# EAGLE design rtk1010_test (EAGLE 9.6.2)
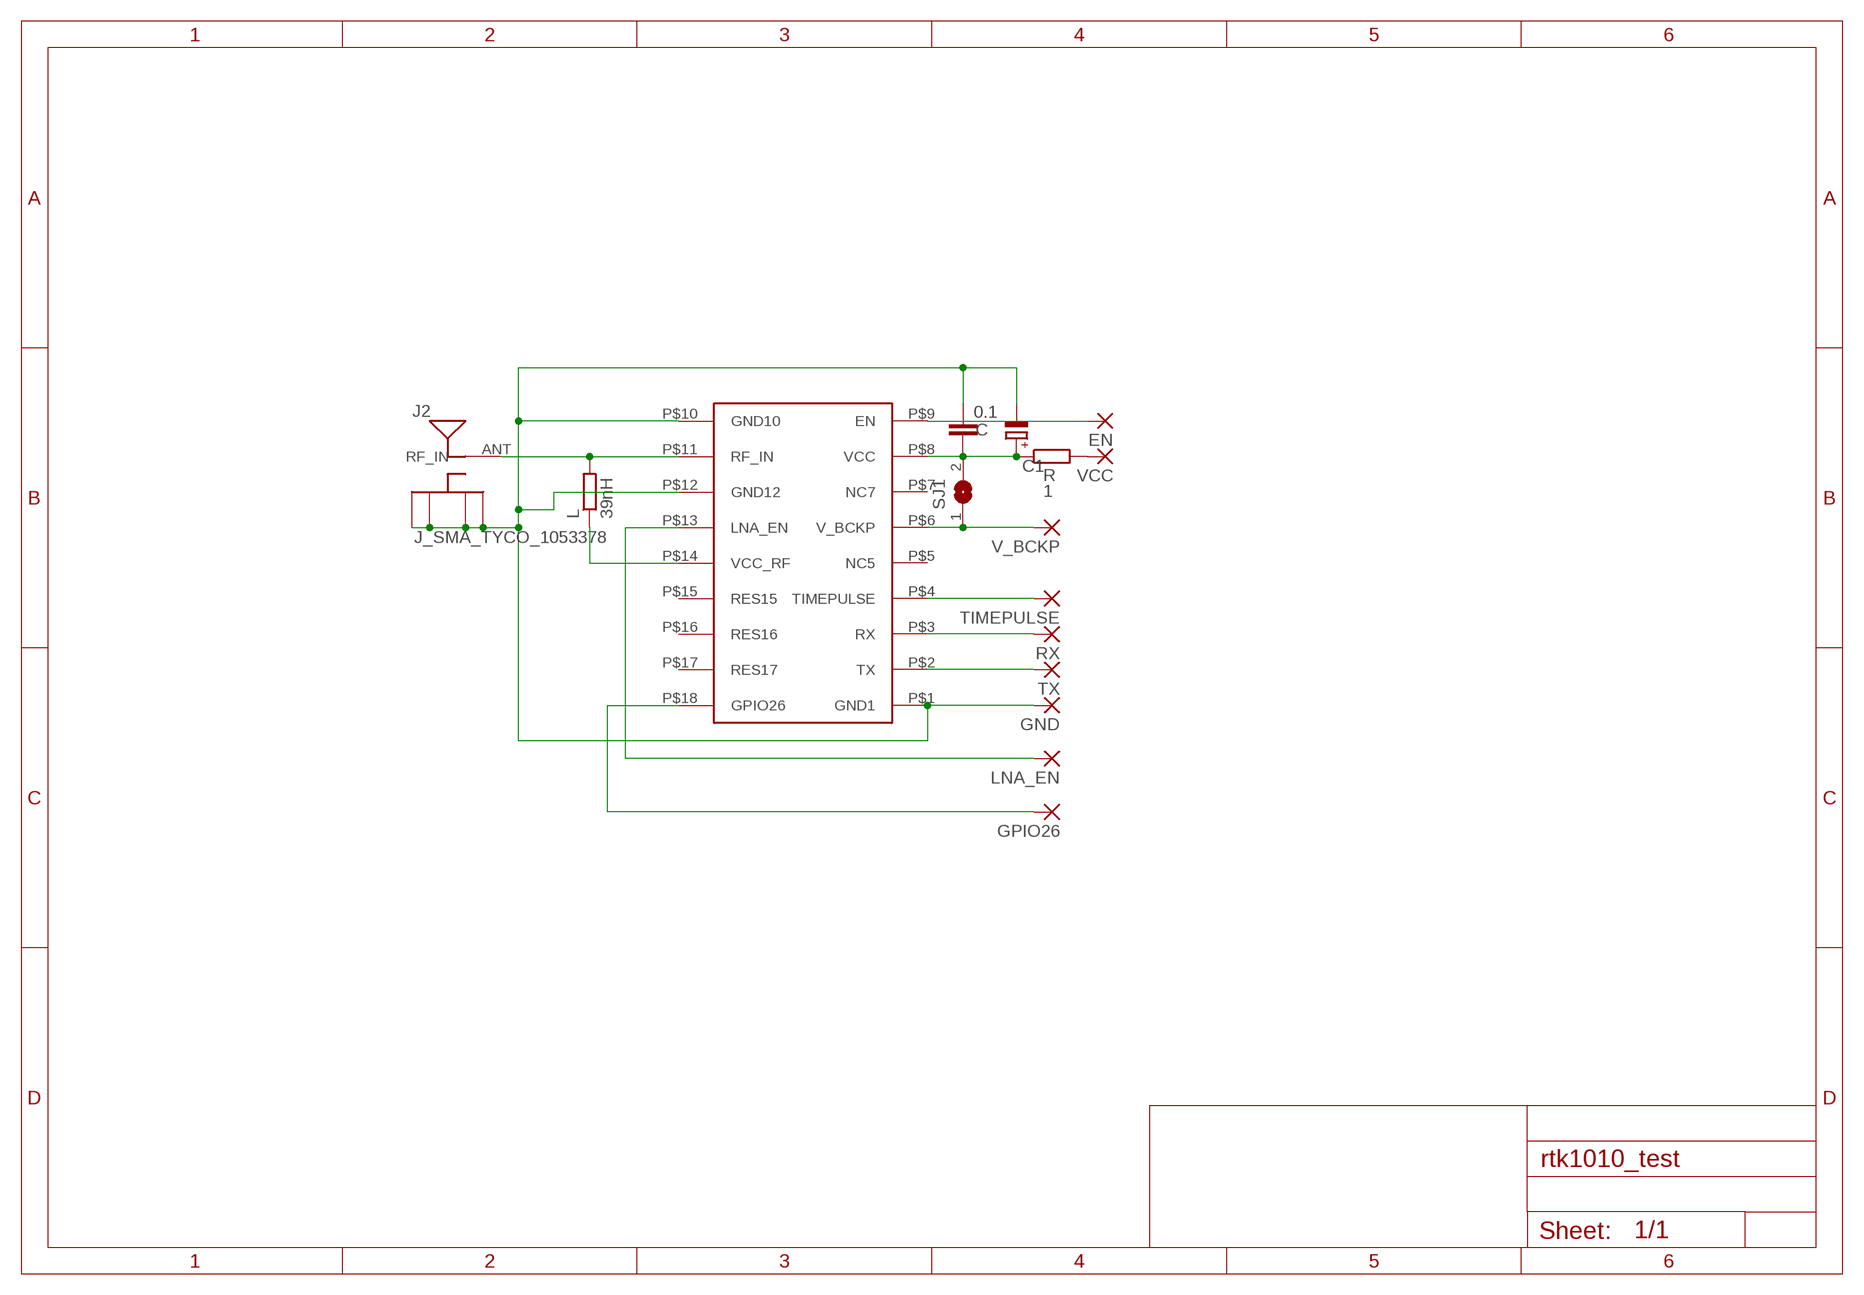
[diagram p0: schematic, sheet 1]

## Parts
C  0.1  C-EUC0805  [C0805]
C1  CPOL-EUSMCB  [SMC_B]
EN  2,15/1,0  [2,15/1,0]
GND  2,15/1,0  [2,15/1,0]
GPIO26  2,15/1,0  [2,15/1,0]
J2  J_SMA_TYCO_1053378  [1053378-1]
L  39nH  R-EU_R0805  [R0805]
LNA_EN  2,15/1,0  [2,15/1,0]
R  1  R-EU_R0805  [R0805]
RX  2,15/1,0  [2,15/1,0]
SJ1  SJW  [SJW]
TIMEPULSE  2,15/1,0  [2,15/1,0]
TX  2,15/1,0  [2,15/1,0]
U$1  RTK-1010  [RTK-1010]
V_BCKP  2,15/1,0  [2,15/1,0]
VCC  2,15/1,0  [2,15/1,0]

## Nets
EN: EN.1(P) U$1.P$9(EN)
GND: C1.- C.2 GND.1(P) J2.GND_1(RFGND_1) J2.GND_2(RFGND_2) J2.GND_3(RFGND_3) J2.GND_4(RFGND_4) U$1.P$1(GND1) U$1.P$10(GND10) U$1.P$12(GND12)
GPIO26: GPIO26.1(P) U$1.P$18(GPIO26)
LNA_EN: LNA_EN.1(P) U$1.P$13(LNA_EN)
N$8: L.1 U$1.P$14(VCC_RF)
N$11: R.2 VCC.1(P)
RF_IN: J2.ANT(RF_IN) L.2 U$1.P$11(RF_IN)
RX: RX.1(P) U$1.P$3(RX)
TIMEPULSE: TIMEPULSE.1(P) U$1.P$4(TIMEPULSE)
TX: TX.1(P) U$1.P$2(TX)
V_BKUP: SJ1.1 U$1.P$6(V_BCKP) V_BCKP.1(P)
VCC: C1.+ C.1 R.1 SJ1.2 U$1.P$8(VCC)
Unconnected: U$1.P$5(NC5) U$1.P$7(NC7) U$1.P$15(RES15) U$1.P$16(RES16) U$1.P$17(RES17)

## Library data of the parts
C = rcl:C-EU: CAPACITOR, European symbol; SPICEPREFIX: C
C1 = rcl:CPOL-EU: POLARIZED CAPACITOR, European symbol; SPICEPREFIX: C
EN GND GPIO26 LNA_EN RX TIMEPULSE TX V_BCKP VCC = wirepad:2,15/1,0: THROUGH-HOLE PAD
J2 = j_sma_tyco_1053378-1:J_SMA_TYCO_1053378: Tyco SMA Antenna
L R = rcl:R-EU_: RESISTOR, European symbol; SPICEPREFIX: R
SJ1 = jumper:SJ: SMD solder JUMPER
U$1 = rtk1010:RTK-1010

## Board
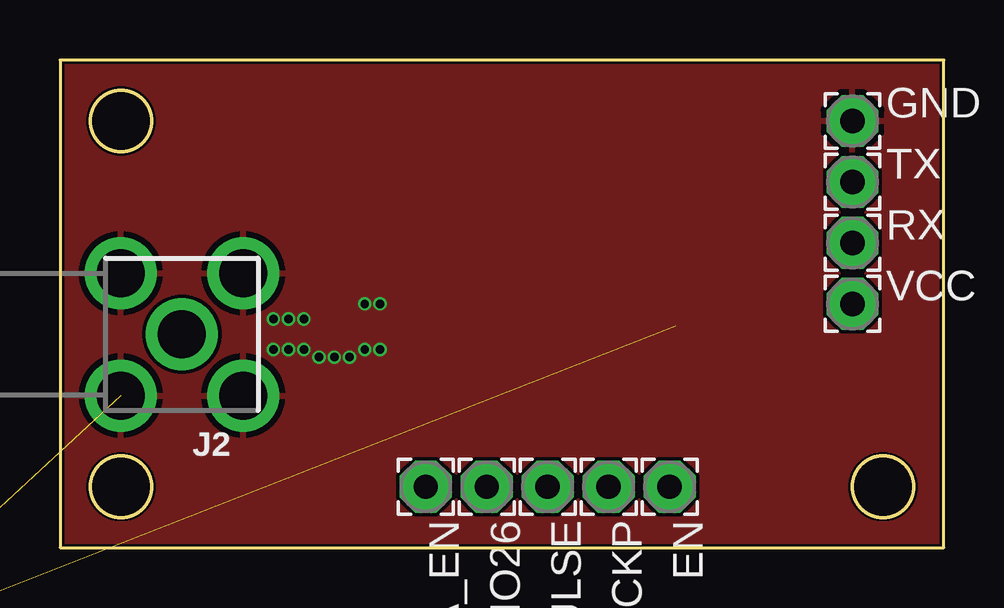
[diagram p1: board, top side]
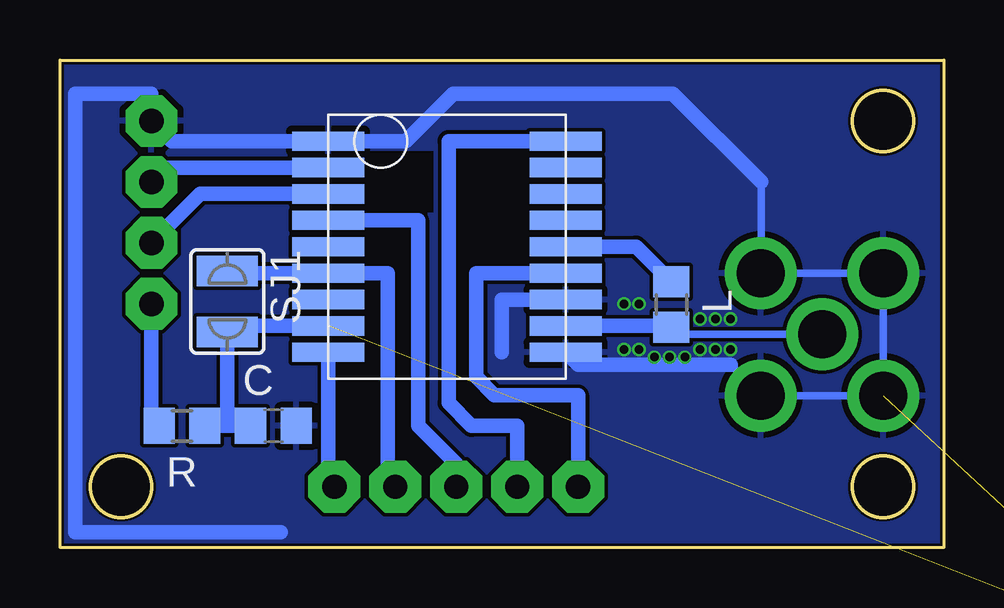
[diagram p2: board, bottom side, seen from below]

Size 36.83 x 20.32 mm. Coordinates in mm from the lower left corner, seen from the top.
Outline: 0,0 36.83,0 36.83,20.32 0,20.32 0,0
Outline: circle at 2.54,2.54 radius 1.27
Outline: circle at 2.54,17.78 radius 1.27
Outline: circle at 34.29,2.54 radius 1.27
Copper layers (1*16): Top 0.035mm / dielectric 0.2mm / Bottom 0.035mm
Design rules "jlcpcb-2-layer *": minimum track width 3.5mil, minimum drill 0.2mm, track to track 6mil, track to pad 6mil, pad to pad 6mil, via to via 6mil, smd to smd 0mil, copper to edge 0.1mm, drill to drill 5mil, minimum pad ring 4mil, minimum via ring 4mil, stop-mask expansion 3mil, vias tented up to drill 100mil, thermal gap 10mil
bRestrict: area 21.3,14 to 24.1,16.5

### Footprints (pad centres in the part's own frame; a part is rotated, then mirrored left to right if it is on the bottom)
C0805 = smd 1.3 x 1.5: 1 -0.95,0; 2 0.95,0
SMC_B = smd 1.6 x 2.4: + -1.5,0; - 1.5,0
2,15/1,0 = drill 1.016 pad 2.159 octagon: 1 0,0
1053378-1 = drill 2 pad 3: ANT 0,0; GND_1 2.55,2.55; GND_2 2.55,-2.55; GND_3 -2.55,2.55; GND_4 -2.55,-2.55
R0805 = smd 1.3 x 1.5: 1 -0.95,0; 2 0.95,0
SJW = smd 1.27 x 2.54: 1 -1.27,0; 2 1.27,0
RTK-1010 = smd 3 x 0.8: P$1 9.9,0; P$2 9.9,1.1; P$3 9.9,2.2; P$4 9.9,3.3; P$5 9.9,4.4; P$6 9.9,5.5; P$7 9.9,6.6; P$8 9.9,7.7; P$9 9.9,8.8; P$10 0,8.8; P$11 0,7.7; P$12 0,6.6; P$13 0,5.5; P$14 0,4.4; P$15 0,3.3; P$16 0,2.2; P$17 0,1.1; P$18 0,0

### Placement (x,y rotation side)
C  27.94,5.08 0 bottom
C1  -12.7,-6.35 0 top  (outside the outline)
EN  25.4,2.54 270 top
GND  33.02,17.78 270 top
GPIO26  17.78,2.54 270 top
J2  5.08,8.89 180 top
L  11.36,10.13 270 bottom
LNA_EN  15.24,2.54 270 top
R  31.75,5.08 180 bottom
RX  33.02,12.7 270 top
SJ1  29.86,10.26 270 bottom
TIMEPULSE  20.32,2.54 270 top
TX  33.02,15.24 270 top
U$1  15.76,16.94 180 bottom
V_BCKP  22.86,2.54 270 top
VCC  33.02,10.16 0 top

### Tracks (layer width: path | path; a pad name or v marks a point on that pad's centre or on a via)
EN
  Bottom 0.61: U$1.P$9 25.66,2.8 EN.1
GND  (via drill 0.35)  (1 unrouted)
  Bottom 0.305: 7.62,15.24 J2.GND_4 J2.GND_2 J2.GND_1 J2.GND_3 7.63,6.36 8.89,7.62
  Bottom 0.61: U$1.P$12 18.41,10.34 18.41,8.14 | 27.62,0.64 36.2,0.64 36.2,18.92 33.02,18.92 GND.1 32.18,16.94 U$1.P$1 22.43,16.94 20.45,18.92 11.3,18.92 7.62,15.24 | U$1.P$10 15.24,7.62 8.89,7.62
  other vias: 8.89,8.26 9.53,8.26 10.16,8.26 8.89,9.53 9.53,9.53 10.16,9.53 12.7,10.16 13.34,10.16 13.34,8.26 12.7,8.26 10.79,7.94 11.43,7.94 12.06,7.94
  pour Bottom: 0,0 36.83,0 36.83,20.32 0,20.32
  pour Top: 0,0 36.83,0 36.83,20.32 0,20.32
GPIO26
  Bottom 0.61: U$1.P$18 20.64,16.94 20.64,6.03 19.68,5.08 17.78,5.08 GPIO26.1
LNA_EN
  Bottom 0.61: LNA_EN.1 15.24,6.35 18.73,6.35 19.49,7.11 19.49,11.44 U$1.P$13
N$8
  Bottom 0.61: U$1.P$14 12.82,12.54 L.1
N$11
  Bottom 0.61: VCC.1 33.02,5.4 R.2
RF_IN
  Bottom 0.305: J2.ANT 11.36,8.89
  Bottom 0.61: 11.36,8.89 L.2 11.42,9.24 U$1.P$11
RX
  Bottom 0.61: U$1.P$3 30.98,14.74 RX.1
TIMEPULSE
  Bottom 0.61: U$1.P$4 21.91,13.64 21.91,5.08 20.32,3.49 TIMEPULSE.1
TX
  Bottom 0.61: U$1.P$2 32.42,15.84 TX.1
V_BKUP
  Bottom 0.61: SJ1.1 29.77,11.44 U$1.P$6 23.18,11.43 23.18,2.86 V_BCKP.1
VCC  (1 unrouted)
  Bottom 0.152: 30.48,5.08 R.1
  Bottom 0.61: U$1.P$8 29.6,9.24 SJ1.2 29.86,5.08 R.1 | C.1 30.48,5.08